# Altium schematic sheet TB-S5D5_p05_JLink_OB-S124_QFP-v1.2.SchDoc: Renesas AE-CAP1-S3 Target Board
size Legal; Author: Jorge Amodio; Organization: Serious Integrated, Inc.; Address1: 145 s 79th Street; Address2: Suite 34; Address3: Chandler, AZ 85226; Address4: USA; DocumentNumber: 5; Revision: PCB02; SheetNumber: 5; SheetTotal: 5; CompanyURL: www.seriousintegrated.com; ReleaseDate: 8/12/2016; Version: v1.1; Company Name: Renesas Electronics America; PageSetup: Record=PageOptions|CenterHorizontal=True|CenterVertical=True|PrintScale=1.00|XCorrection=1.00|YCorrection=1.00|PrintKind=1|BorderSize=5000000|LeftOffset=0|BottomOffset=0|Orientation=2|PaperLength=1000|PaperWidth=1000|Scale=100|PaperSource=7|PrintQuality=-4|MediaType=1|DitherType=10|PaperKind=A5 148x210mm|PrintScaleMode=1
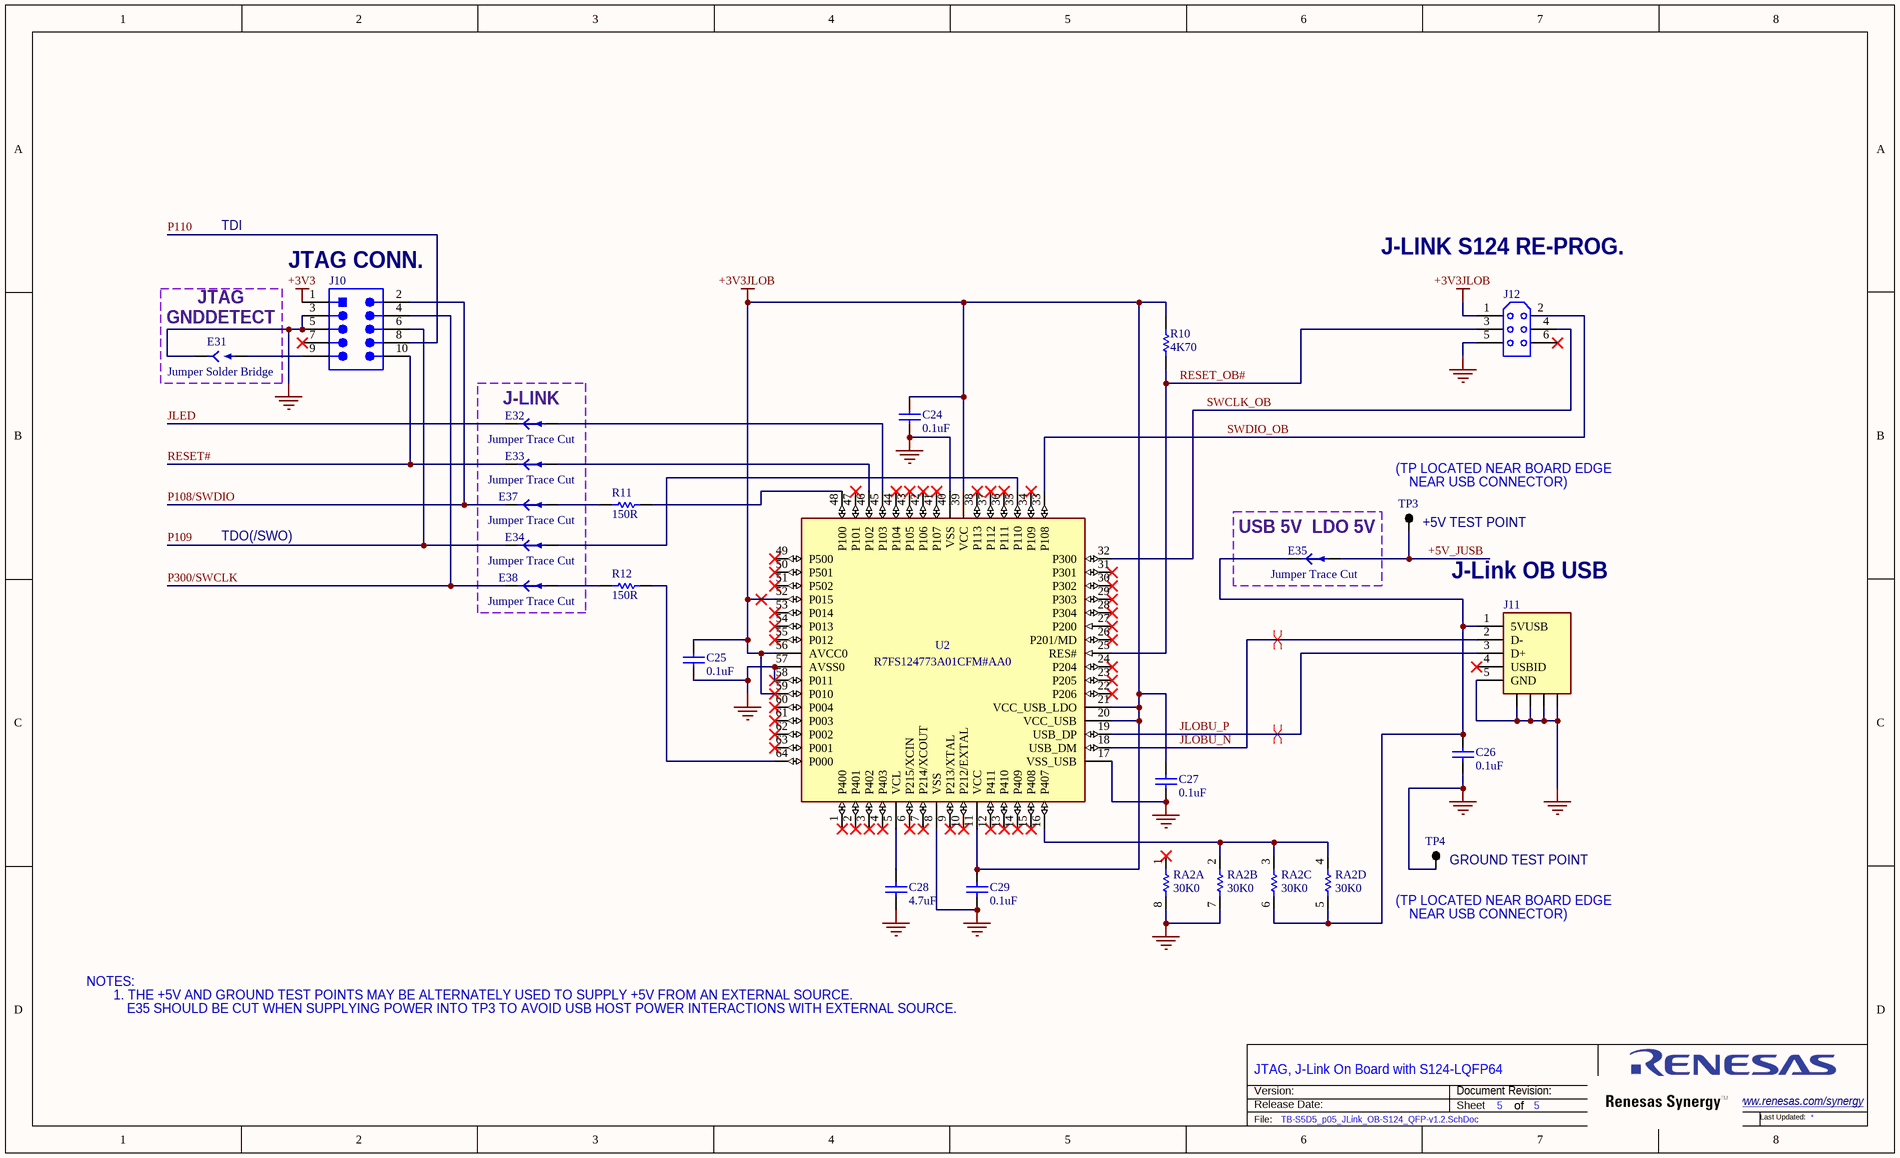
[diagram p0: TB-S5D5_p05_JLink_OB-S124_QFP-v1.2.SchDoc]

## Parts
C24  Capacitance: 0.1uF  [CAPC0603-01]  (hidden comment: CAP-000029-01)
C25  Capacitance: 0.1uF  [CAPC0603-01]  (hidden comment: CAP-000029-01)
C26  Capacitance: 0.1uF  [CAPC0603-01]  (hidden comment: CAP-000029-01)
C27  Capacitance: 0.1uF  [CAPC0603-01]  (hidden comment: CAP-000029-01)
C28  Capacitance: 4.7uF  [CAPC0603-01]  (hidden comment: CAP-000043-01)
C29  Capacitance: 0.1uF  [CAPC0603-01]  (hidden comment: CAP-000029-01)
E31  Jumper Solder Bridge  [E_PadsSplit0805]  (no BOM)
E32  Jumper Trace Cut  [E_PadsTraceCut0805]  (net tie, no BOM)
E33  Jumper Trace Cut  [E_PadsTraceCut0805]  (net tie, no BOM)
E34  Jumper Trace Cut  [E_PadsTraceCut0805]  (net tie, no BOM)
E35  Jumper Trace Cut  [E_PadsTraceCut0805]  (net tie, no BOM)
E37  Jumper Trace Cut  [E_PadsTraceCut0805]  (net tie, no BOM)
E38  Jumper Trace Cut  [E_PadsTraceCut0805]  (net tie, no BOM)
J10  CON-REN001-01  [J_10pTH2cx5r]  (value not drawn)
J11  CON-000116-01  [FCI_10118192]  (value not drawn)
J12  CON-000241-01  [TC2030NL]  (value not drawn)
R10  Resistance: 4K70  [RESC0402-01]  (hidden comment: RES-000127-01)
R11  Resistance: 150R  [RESC0402-01]  (hidden comment: RES-000220-01)
R12  Resistance: 150R  [RESC0402-01]  (hidden comment: RES-000220-01)
RA2  Resistance: 30K0  [RESCAF0804]  (hidden comment: RES-000117-01)  (parts A,B,C,D of 4)
TP3  Test Point  [TP_40milTHpad]  (value not drawn)  (no BOM)
TP4  Test Point  [TP_40milTHpad]  (value not drawn)  (no BOM)
U2  Display Name: R7FS124773A01CFM#AA0  [RENESAS_PLQP0064KB-A_N]  (hidden comment: ICN-000202-01)

## Blocks framed on the sheet
J-LINK: E32-E34 E37 E38
USB 5V  LDO 5V: E35

## Nets
+3V3: J10.1
+3V3JLOB: C24.2 C25.2 C27.2 C29.2 J12.1 R10.2 U2.11(VCC) U2.20(VCC_USB) U2.21(VCC_USB_LDO) U2.39(VCC) U2.52(P015) U2.56(AVCC0) U2.59(P010)
GND: C24.1 C25.1 C26.1 C27.1 C28.2 C29.1 E31.1(A) J10.3 J10.5 J11.5(GND) J11.C1 J11.C2 J11.C3 J11.C4 J12.5 RA2.7 RA2.8 TP4.1(TP) U2.8(VSS) U2.17(VSS_USB) U2.40(VSS) U2.57(AVSS0) U2.58(P011)
+5V_JUSB: E35.2(A) TP3.1(TP)
JLED: E32.1(A)
JLOBU_N: J11.2(D-) U2.18(USB_DM)
JLOBU_P: J11.3(D+) U2.19(USB_DP)
P108/SWDIO: E37.1(A) J10.2
P109: E34.1(A) J10.6
P110: J10.8
P300/SWCLK: E38.1(A) J10.4
RESET#: E33.1(A) J10.10
RESET_OB#: J12.3 R10.1 U2.25(RES#)
SWCLK_OB: J12.4 U2.32(P300)
SWDIO_OB: J12.2 U2.33(P108)
NetC26_2: C26.2 E35.1(A) J11.1(5VUSB) RA2.5 RA2.6
NetC28_1: C28.1 U2.5(VCL)
NetE31_2: E31.2(A) J10.9
NetE32_2: E32.2(A) U2.45(P103)
NetE33_2: E33.2(A) U2.46(P102)
NetE34_2: E34.2(A) U2.35(P110)
NetE37_2: E37.2(A) R11.1
NetE38_2: E38.2(A) R12.1
NetR11_2: R11.2 U2.48(P100)
NetR12_2: R12.2 U2.64(P000)
NetRA2_2: RA2.2 RA2.3 RA2.4 U2.16(P407)

Not connected (* = marked no-connect by the designer): J10 7*; J11 4(USBID)*; J12 6*; RA2 1*; U2 1(P400)* 2(P401)* 3(P402)* 4(P403)* 6(P215/XCIN)* 7(P214/XCOUT)* 9(P213/XTAL)* 10(P212/EXTAL)* 12(P411)* 13(P410)* 14(P409)* 15(P408)* 22(P206)* 23(P205)* 24(P204)* 26(P201/MD)* 27(P200)* 28(P304)* 29(P303)* 30(P302)* 31(P301)* 34(P109)* 36(P111)* 37(P112)* 38(P113)* 41(P107)* 42(P106)* 43(P105)* 44(P104)* 47(P101)* 49(P500)* 50(P501)* 51(P502)* 53(P014)* 54(P013)* 55(P012)* 60(P004)* 61(P003)* 62(P002)* 63(P001)*

## Layout directives
differential pair: JLOBU_N, JLOBU_P

## Notes on the sheet
- TDI
- (near J10) JTAG CONN.
- J-LINK S124 RE-PROG.
- (near E31) JTAG
- (near E31) GNDDETECT
- (near TP3) (TP LOCATED NEAR BOARD EDGE
- (near TP3) NEAR USB CONNECTOR)
- TDO(/SWO)
- (near TP3) +5V TEST POINT
- J-Link OB USB
- (near TP4) (TP LOCATED NEAR BOARD EDGE
- (near TP4) GROUND TEST POINT
- (near TP4) NEAR USB CONNECTOR)
- NOTES:
- 1. THE +5V AND GROUND TEST POINTS MAY BE ALTERNATELY USED TO SUPPLY +5V FROM AN EXTERNAL SOURCE.
- E35 SHOULD BE CUT WHEN SUPPLYING POWER INTO TP3 TO AVOID USB HOST POWER INTERACTIONS WITH EXTERNAL SOURCE.
- JTAG, J-Link On Board with S124-LQFP64
- Version:
- Release Date:
- Document Revision:
- Sheet
- of
- www.renesas.com/synergy <http://www.renesas.com/synergy>
- File:
- 60
- Last Updated:

## Library data of the parts
C24-C27 C29 = CAP-000029-01: Ceramic Chip Capacitor 0603 0.1uF 50V; Manufacturer: Samsung; Mfg Part Number: CL10B104KB8NNNC; Dialectric: X7R; Tolerance: 10%; Voltage: 50V; Package: 0603
C28 = CAP-000043-01: Ceramic Chip Capacitor 0603 4.7uF 6.3V; Manufacturer: Samsung; Mfg Part Number: CL10A475KQ8NNNL; Dialectric: X5R; Tolerance: 10%; Voltage: 6.3V; Package: 0603
E31 = E_JmpSldrBridge: Pads on PCB with Narrow Gap to allow Solder Bridging
E32-E35 E37 E38 = E_JmpTraceCut: Pads on PCB with Trace Between for Cutting to isolate
J10 = CON-REN001-01: 10 Position Shrouded Header 1.27mm Pitch; Manufacturer: CNC Tech; Mfg Part Number: 3220-10-0100-00; Positions: 10; Pitch: 1.27mm
J11 = CON-000116-01: USB Micro 2.0 Female 5 Pin Right Angle; Manufacturer: FCI; Mfg Part Number: 10118192-0001LF
J12 = CON-000241-01: Tag Connect TC-2030 PCB Pads 6 Pos 2x3
R10 = RES-000127-01: Chip Resistor Thick Film 0402 4K70 0.5% 1/16W; Manufacturer: Panasonic; Mfg Part Number: ERA-2AED472X; Package: 0402; Power: 1/16W; Tolerance: 0.5%
R11 R12 = RES-000220-01: Chip Resistor Thick Film 0402 150R 1% 1/10W; Manufacturer: Panasonic; Mfg Part Number: ERJ-2RKF1500X; Package: 0402; Power: 1/10W; Tolerance: 1%
RA2 = RES-000117-01: Chip Resistor Array 0804 30K0 5% 1/16W 4 x 0402; Manufacturer: Panasonic; Mfg Part Number: EXB-28V303JX; Package: 0804; Power: 1/16W; Tolerance: 5%
TP3 TP4 = TP_TH: Test Point, Through Hole Pad 40mil ID
U2 = ICN-000202-01: Renesas S124 32-Bit 32MHz Cortex M0+ MCU LQFP64; Architecture: 32bits; CAN: 1; Ethernet: 0; FLASH E2ROM: TBD; FLASH ROM: TBD; Manufacturer: Renesas; Max Clock Speed: 32MHz; Mfg Part Number: R7FS124773A01CFM#AA0; Package: LQFP-64; RAM: TBD